# EAGLE design baseboard (EAGLE 9.6.1)
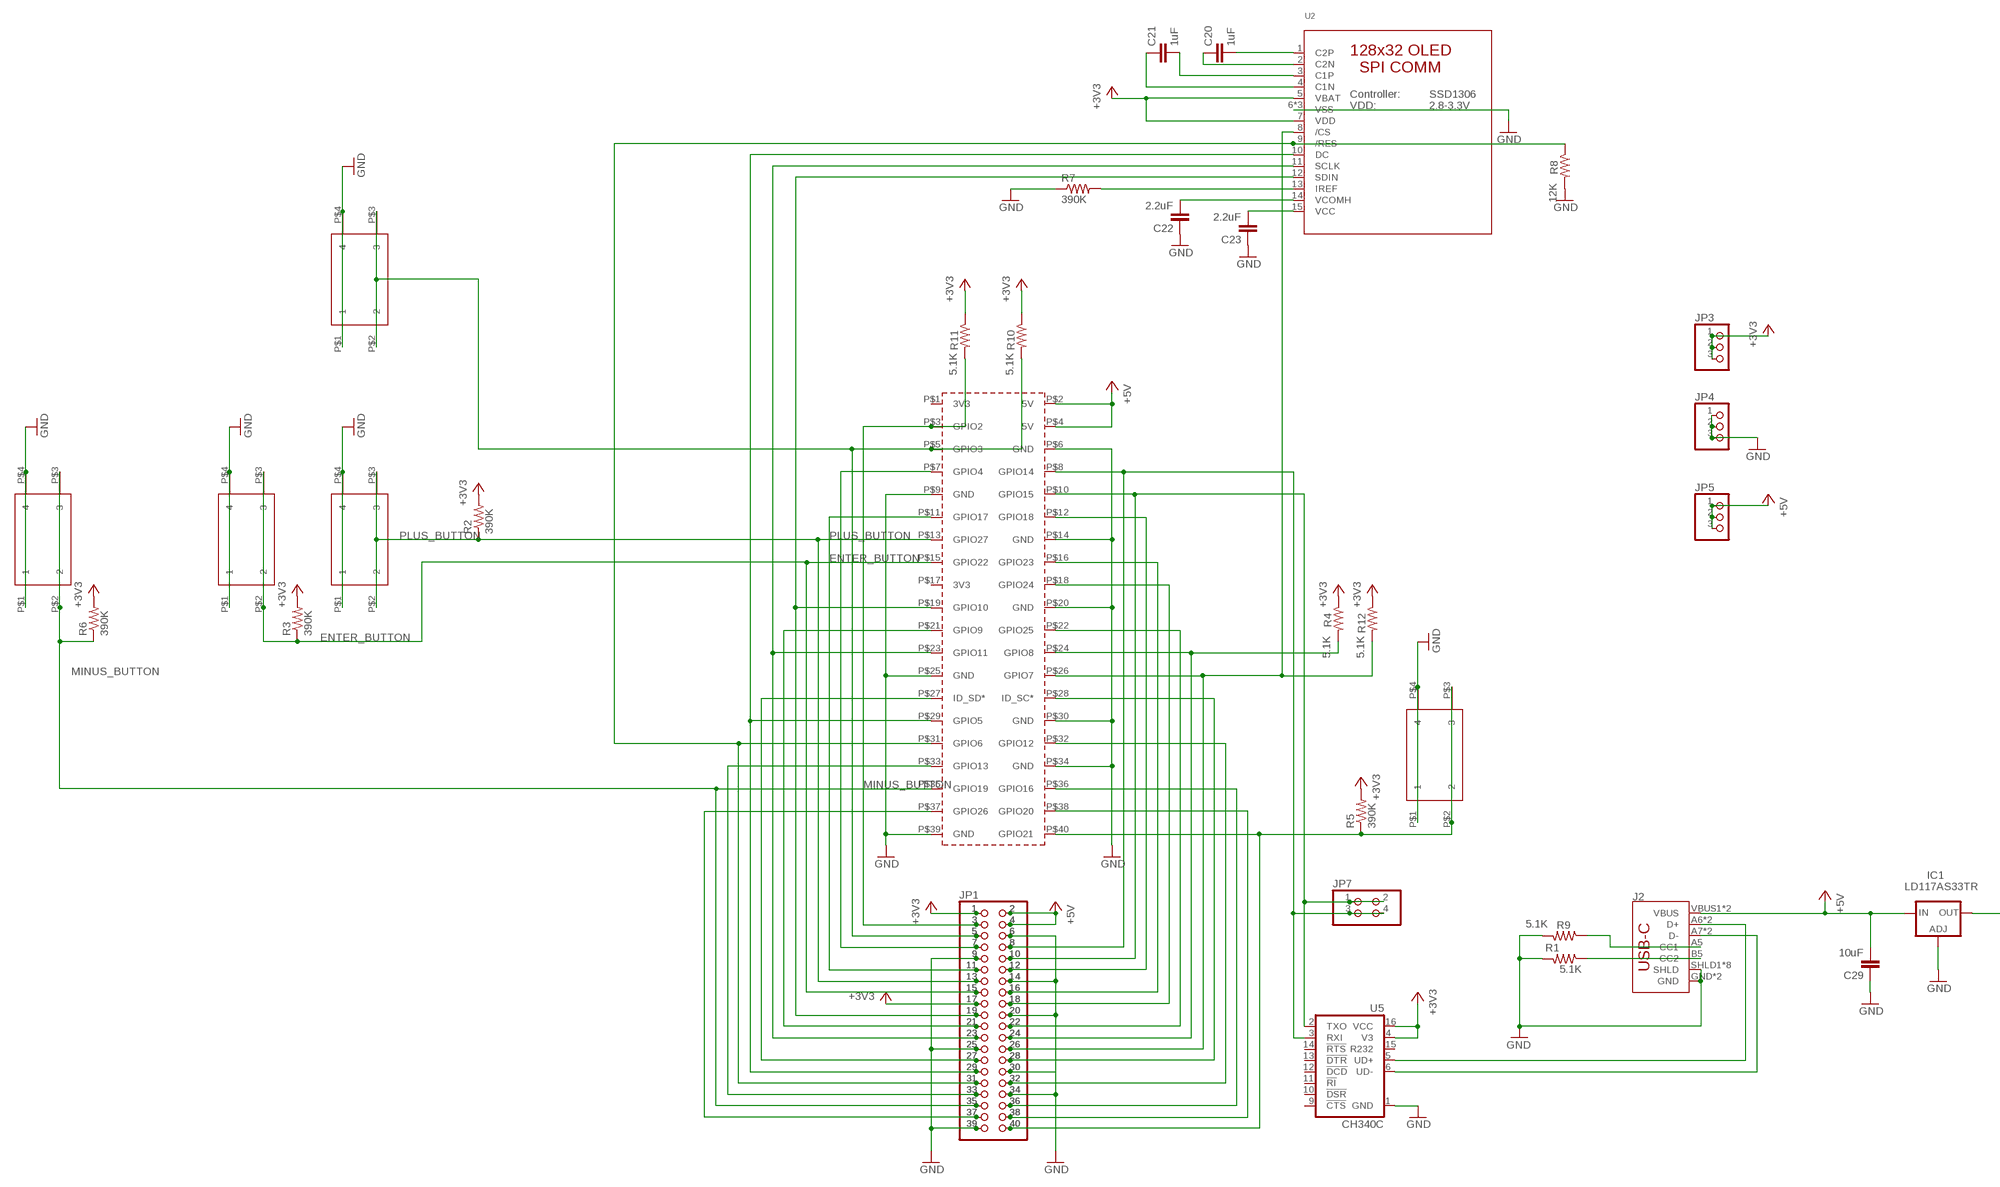
[diagram p0: schematic, sheet 1, part 1 of 2]
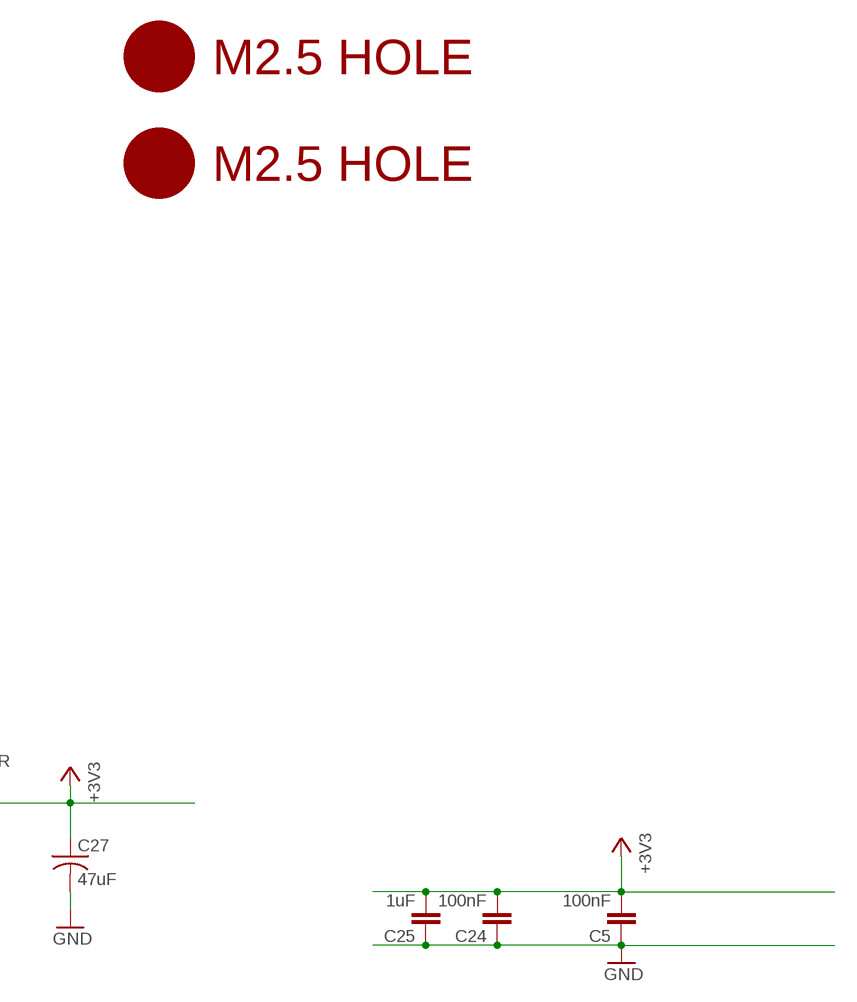
[diagram p1: schematic, sheet 1, part 2 of 2]

## Parts
C5  100nF  CAP0805  [0805]
C20  1uF  CAP0805  [0805]
C21  1uF  CAP0805  [0805]
C22  2.2uF  CAP0805  [0805]
C23  2.2uF  CAP0805  [0805]
C24  100nF  CAP0805  [0805]
C25  1uF  CAP0805  [0805]
C27  47uF  C-USC1210  [C1210]
C29  10uF  CAP0805  [0805]
IC1  LD117AS33TR  [SOT223]
J2  USB_C16PIN  [USB-C-16P]
JP1  PINHD-2X20-BIG  [2X20-BIG]
JP2  PINHD-2X20-BIG  [2X20-BIG]
JP3  PINHD-1X3  [1X03]
JP4  PINHD-1X3  [1X03]
JP5  PINHD-1X3  [1X03]
JP7  PINHD-2X2  [2X02]
PCB1  RPI3NO-CONNECTORS  [RPI3-NO-CONNECTORS]
R1  5.1K  RESISTOR0805-RES  [0805]
R2  390K  RESISTOR0805-RES  [0805]
R3  390K  RESISTOR0805-RES  [0805]
R4  5.1K  RESISTOR0805-RES  [0805]
R5  390K  RESISTOR0805-RES  [0805]
R6  390K  RESISTOR0805-RES  [0805]
R7  390K  RESISTOR0805-RES  [0805]
R8  12K  RESISTOR0805-RES  [0805]
R9  5.1K  RESISTOR0805-RES  [0805]
R10  5.1K  RESISTOR0805-RES  [0805]
R11  5.1K  RESISTOR0805-RES  [0805]
R12  5.1K  RESISTOR0805-RES  [0805]
SW1  324_SW  [342_SWICH_FOOT]
SW2  324_SW  [342_SWICH_FOOT]
SW3  324_SW  [342_SWICH_FOOT]
SW4  324_SW  [342_SWICH_FOOT]
SW20  324_SW  [342_SWICH_FOOT]
U2  LUL_DISP_OLED_UG-2864HSWEG01  [LUL_UG-2864HSWEG01_1.3_WRAPAROUND]
U5  CH340C  [SO016]
U$2  M2.5HOLE  [M2.5HOLE]
U$3  M2.5HOLE  [M2.5HOLE]

## Nets
+3V3: C5.2 C24.2 C25.2 C27.1 IC1.4(OUT) JP1.1 JP1.17 JP2.1 JP2.17 JP3.1 JP3.2 JP3.3 R2.2 R3.2 R4.1 R5.2 R6.2 R10.1 R11.1 R12.1 U2.5(VBAT) U2.7(VDD) U5.4(V3) U5.16(VCC)
+5V: C29.2 IC1.3(IN) J2.VBUS1(VBUS) J2.VBUS2(VBUS) JP1.2 JP1.4 JP2.2 JP2.4 JP5.1 JP5.2 JP5.3 PCB1.P$2(5V) PCB1.P$4(5V)
ENTER_BUTTON: JP1.15 JP2.15 PCB1.P$15(GPIO22) R3.1 SW20.P$2 SW20.P$3
GND: C5.1 C22.1 C23.1 C24.1 C25.1 C27.2 C29.1 IC1.1(ADJ) J2.GND J2.GND2(GND) J2.SHLD1(SHLD) J2.SHLD2(SHLD) J2.SHLD3(SHLD) J2.SHLD4(SHLD) J2.SHLD5(SHLD) J2.SHLD6(SHLD) J2.SHLD7(SHLD) J2.SHLD8(SHLD) JP1.6 JP1.9 JP1.14 JP1.20 JP1.25 JP1.30 JP1.34 JP1.39 JP2.6 JP2.9 JP2.14 JP2.20 JP2.25 JP2.30 JP2.34 JP2.39 JP4.1 JP4.2 JP4.3 PCB1.P$6(GND) PCB1.P$9(GND) PCB1.P$14(GND) PCB1.P$20(GND) PCB1.P$25(GND) PCB1.P$30(GND) PCB1.P$34(GND) PCB1.P$39(GND) R1.2 R7.1 R8.2 R9.2 SW1.P$1 SW1.P$4 SW2.P$1 SW2.P$4 SW3.P$1 SW3.P$4 SW4.P$1 SW4.P$4 SW20.P$1 SW20.P$4 U2.6(VSS) U2.16(VSS) U2.17(VSS) U5.1(GND)
MINUS_BUTTON: JP1.35 JP2.35 PCB1.P$35(GPIO19) R6.1 SW4.P$2 SW4.P$3
N$1: J2.A6(D+) J2.B6(D+) U5.5(UD+)
N$2: J2.A5(CC1) R9.1
N$3: J2.A7(D-) J2.B7(D-) U5.6(UD-)
N$5: JP1.3 JP2.3 PCB1.P$3(GPIO2) R11.2
N$6: JP1.5 JP2.5 PCB1.P$5(GPIO3) R10.2 SW2.P$2 SW2.P$3
N$7: J2.B5(CC2) R1.1
N$8: JP1.7 JP2.7 PCB1.P$7(GPIO4)
N$9: JP1.11 JP2.11 PCB1.P$11(GPIO17)
N$12: JP1.19 JP2.19 PCB1.P$19(GPIO10) U2.12(SDIN)
N$13: JP1.21 JP2.21 PCB1.P$21(GPIO9)
N$14: JP1.23 JP2.23 PCB1.P$23(GPIO11) U2.11(SCLK)
N$15: JP1.27 JP2.27 PCB1.P$27(ID_SD*)
N$16: JP1.29 JP2.29 PCB1.P$29(GPIO5) U2.10(DC)
N$19: JP1.33 JP2.33 PCB1.P$33(GPIO13)
N$21: JP1.37 JP2.37 PCB1.P$37(GPIO26)
N$22: JP1.12 JP2.12 PCB1.P$12(GPIO18)
N$23: JP1.16 JP2.16 PCB1.P$16(GPIO23)
N$24: JP1.18 JP2.18 PCB1.P$18(GPIO24)
N$25: JP1.22 JP2.22 PCB1.P$22(GPIO25)
N$26: JP1.24 JP2.24 PCB1.P$24(GPIO8) R4.2
N$27: JP1.26 JP2.26 PCB1.P$26(GPIO7) R12.2 U2.8(/CS)
N$28: JP1.28 JP2.28 PCB1.P$28(ID_SC*)
N$29: JP1.32 JP2.32 PCB1.P$32(GPIO12)
N$30: JP1.36 JP2.36 PCB1.P$36(GPIO16)
N$31: JP1.38 JP2.38 PCB1.P$38(GPIO20)
N$32: JP1.40 JP2.40 PCB1.P$40(GPIO21) R5.1 SW3.P$2 SW3.P$3
N$35: C20.2 U2.1(C2P)
N$36: C20.1 U2.2(C2N)
N$37: C21.2 U2.3(C1P)
N$38: C21.1 U2.4(C1N)
N$39: R7.2 U2.13(IREF)
N$40: C22.2 U2.14(VCOMH)
N$41: C23.2 U2.15(VCC)
N$43: JP1.31 JP2.31 PCB1.P$31(GPIO6) R8.1 U2.9(/RES)
PLUS_BUTTON: JP1.13 JP2.13 PCB1.P$13(GPIO27) R2.1 SW1.P$2 SW1.P$3
RPI_RX: JP1.10 JP2.10 JP7.1 JP7.2 PCB1.P$10(GPIO15) U5.2(TXO)
RPI_TX: JP1.8 JP2.8 JP7.3 JP7.4 PCB1.P$8(GPIO14) U5.3(RXI)
Unconnected: PCB1.P$1(3V3) PCB1.P$17(3V3) U5.9(!CTS) U5.10(!DSR) U5.11(!RI) U5.12(!DCD) U5.13(!DTR) U5.14(!RTS) U5.15(R232)

## Library data of the parts
C5 C20-C25 C29 = clock:CAP: Capacitor Standard 0603 ceramic capacitor, and 0.1" leaded capacitor.
C27 = clock:C-US: CAPACITOR, American symbol
IC1 = v-reg:LD117A?*: Low drop fixed and adjustable positive voltage regulators 1 A Source: http://www.st.com/stonline/products/literature/ds/7194/ld1117axx.pdf
J2 = SparkFun-Connectors:USB_C: USB Type C 16Pin Connector Super Speed pins not available on the 16-pin purely SMD connector so this part is best for USB 2.0 implementations. D1 and D2 are tied together enabling D+/- no matter which way the cable is plugged into the connector. The two channel configuration pins (CC1/2) are exposed. These are normally connected to ground via 5.1k resistors but can be reconfigured for high current/high power applications.; PROD_ID: CONN-14122
JP1 JP2 = adafruit_changed:PINHD-2X20: PIN HEADER
JP3-JP5 = pinhead:PINHD-1X3: PIN HEADER
JP7 = pinhead:PINHD-2X2: PIN HEADER
PCB1 = e14_Rpi3_RevA:RPI3: Device for Raspberry Pi 3 board created by Dave Young for www.element14.com More information and support community is available at https://www.element14.com/community/community/raspberry-pi
R1 R4 R8-R12 = joyAnalog:RESISTOR: Resistor Basic schematic elements and footprints for 0603, 1206, and PTH resistors.
R2 R3 R5-R7 = SparkFun-Passives:RESISTOR: Resistor Basic schematic elements and footprints for 0603, 1206, and PTH resistors.
SW1-SW4 SW20 = 3pos_slide_switch_centered:324_SW
U2 = lul:LUL_DISP_OLED_UG-2864HSWEG01: UG-2864HSWEG01 OLED display Both 1.3" and 0.96" models share the same FPC tab footprint, only the screen dimensions vary.
U5 = SparkFun-IC-Comms:CH340C; PROD_ID: IC-14038
U$2 U$3 = f1c100s:M2.5HOLE

## Net classes
1 power: width 0.178 mm

## Board
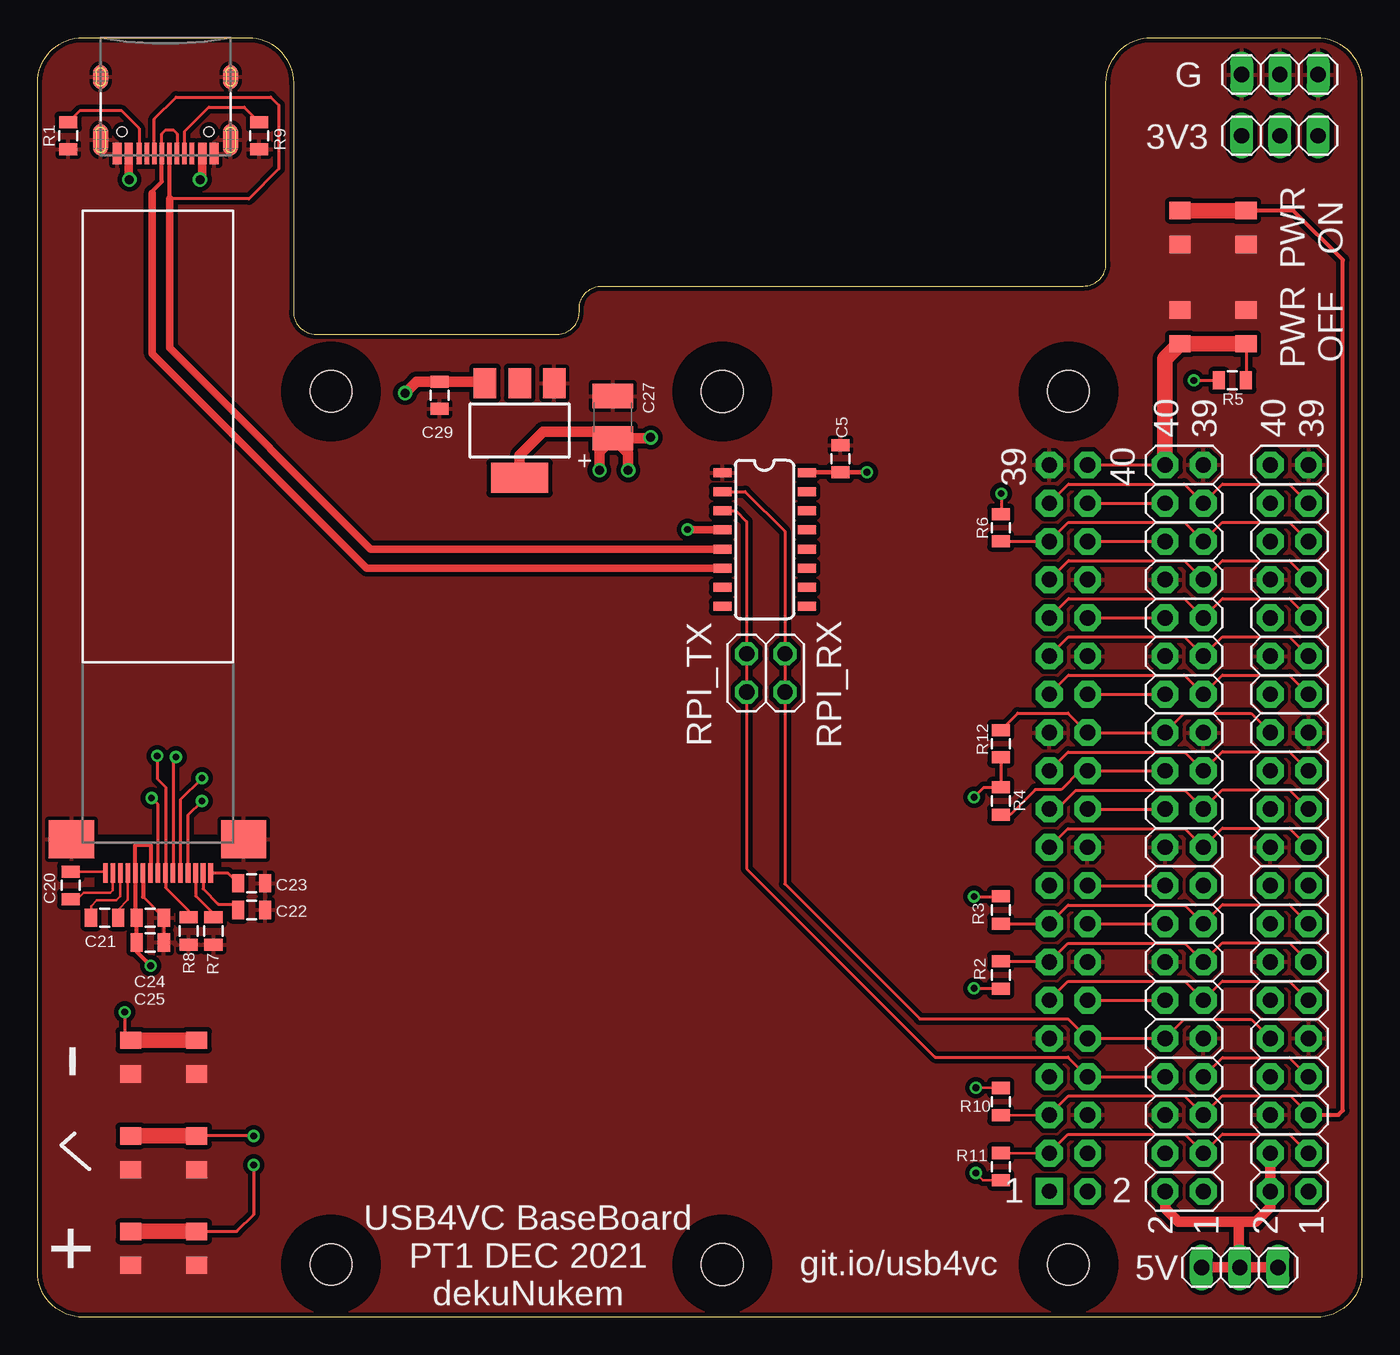
[diagram p2: board, top side]
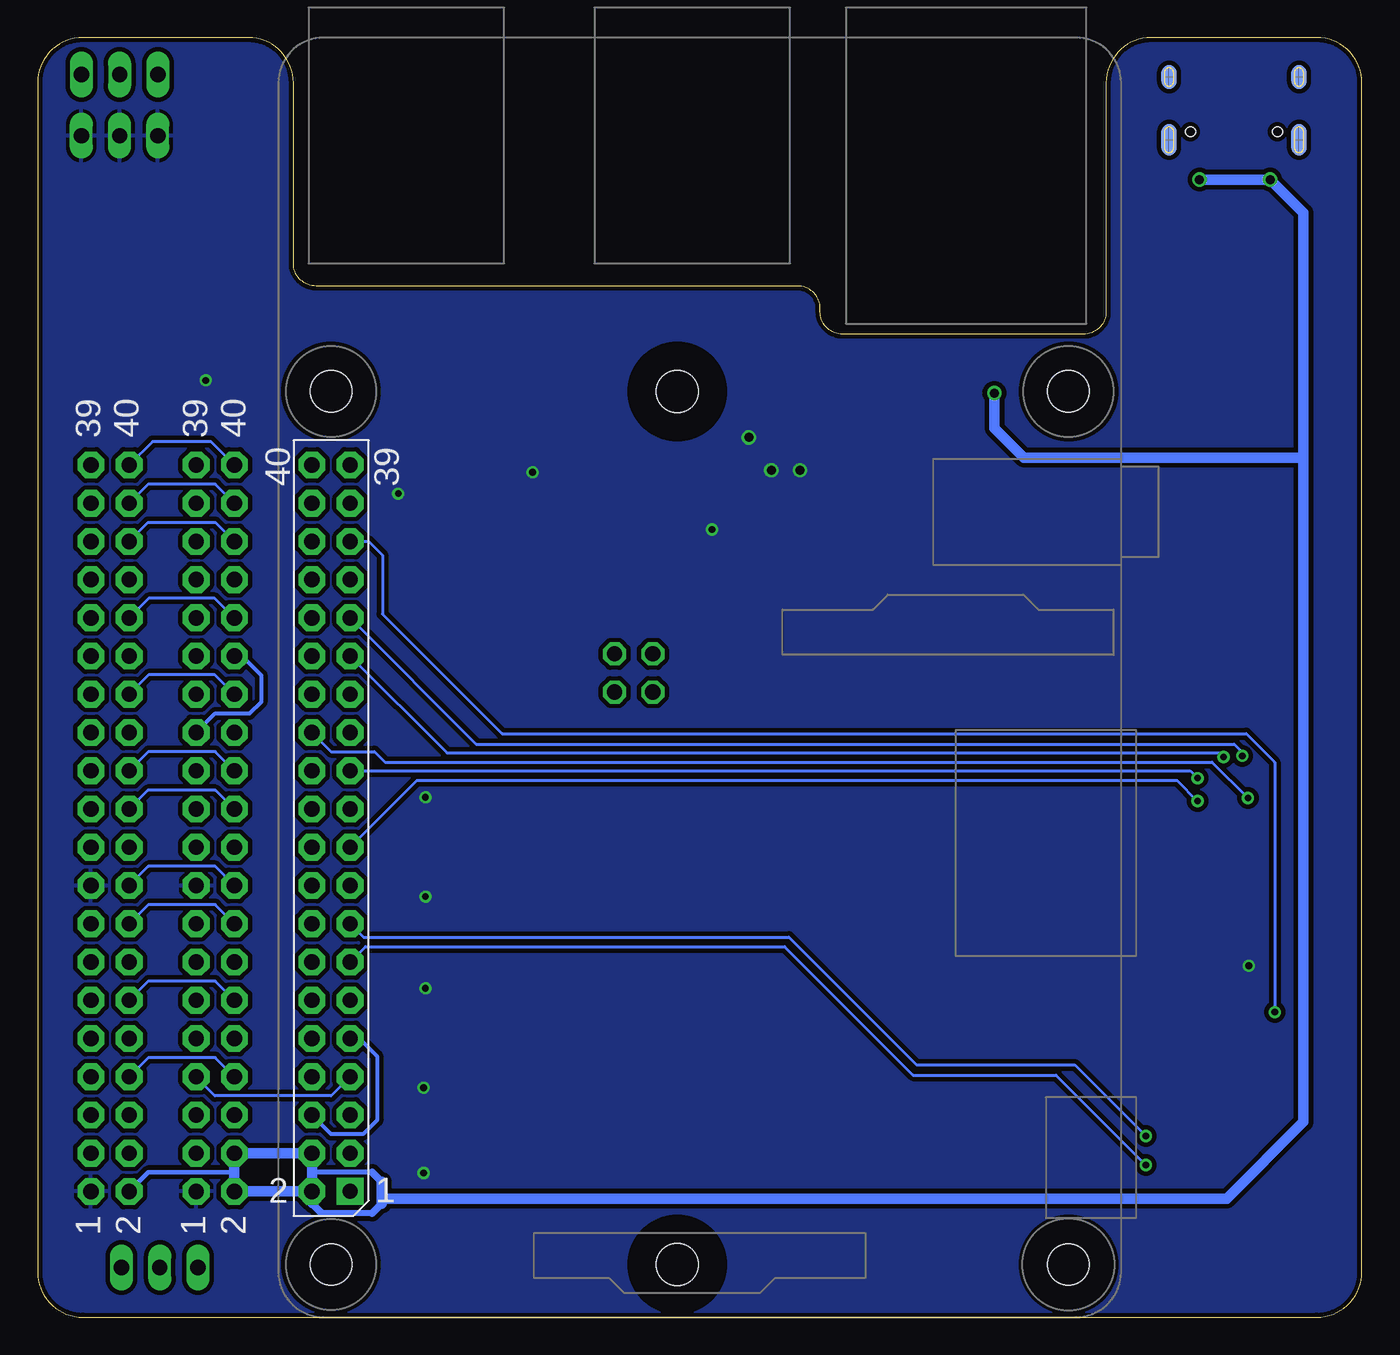
[diagram p3: board, bottom side, seen from below]

Size 88 x 85 mm. Coordinates in mm from the lower left corner, seen from the top.
Outline: 74,85 85,85 arc-90 88,82 88,3 arc-90 85,0 3,0 arc-90 0,3 0,82 arc-90 3,85 14,85 arc-90 17,82 17,66.8 arc90 18.5,65.3 34.5,65.3 arc90 36,66.8 36,67 arc-90 37.5,68.5 69.5,68.5 arc90 71,70 71,82 arc-90 74,85
Copper layers (1*16): Top 0.035mm / dielectric 1.5mm / Bottom 0.035mm
Design rules "deku_2layer_6mil": minimum track width 6mil, minimum drill 15mil, track to track 6mil, track to pad 6mil, pad to pad 6mil, via to via 6mil, smd to smd 6mil, copper to edge 10mil, drill to drill 6mil, minimum pad ring 7mil, minimum via ring 7mil, stop-mask expansion 4mil, vias tented up to drill 25mil, thermal gap 10mil
tRestrict: area 4.1,27.4 to 11.9,31.8; area 65.5,0.5 to 71.5,6.5; area 16.5,0.5 to 22.5,6.5; area 65.5,58.5 to 71.5,64.5; area 16.5,58.5 to 22.5,64.5
bRestrict: area 65.5,58.5 to 71.5,64.5; area 65.5,0.5 to 71.5,6.5; area 16.5,0.5 to 22.5,6.5; area 16.5,58.5 to 22.5,64.5

### Footprints (pad centres in the part's own frame; a part is rotated, then mirrored left to right if it is on the bottom)
0805 = smd 0.8 x 1.2: 1 -0.9,0; 2 0.9,0
C1210 = smd 1.6 x 2.7: 1 -1.4,0; 2 1.4,0
SOT223 = smd 1.5 x 2: 1 -2.3,-3.15; 2 0,-3.15; 3 2.3,-3.15 | smd 3.8 x 2: 4 0,3.15
USB-C-16P = smd 0.3 x 1.45: A5 -1.25,0; A6 -0.25,0; A7 0.25,0; A8 1.25,0; B5 1.75,0; B6 0.75,0; B7 -0.75,0; B8 -1.75,0 | smd 0.6 x 1.45: GND -3.225,0; GND2 3.225,0 | smd 1 x 2.1: SHLD1 -4.32,-0.915; SHLD2 4.32,-0.915 | smd 1 x 2.1 bottom: SHLD3 -4.32,-0.915; SHLD4 4.32,-0.915 | smd 1 x 1.6: SHLD5 -4.32,-5.095; SHLD8 4.32,-5.095 | smd 1 x 1.6 bottom: SHLD6 -4.32,-5.095; SHLD7 4.32,-5.095 | smd 0.55 x 1.45: VBUS1 -2.45,0; VBUS2 2.45,0 | hole 0.65: -2.89,-1.445; 2.89,-1.445
2X20-BIG = drill 1.016 pad 1.778 octagon: 1 -24.13,-1.27; 2 -24.13,1.27; 3 -21.59,-1.27; 4 -21.59,1.27; 5 -19.05,-1.27; 6 -19.05,1.27; 7 -16.51,-1.27; 8 -16.51,1.27; 9 -13.97,-1.27; 10 -13.97,1.27; 11 -11.43,-1.27; 12 -11.43,1.27; 13 -8.89,-1.27; 14 -8.89,1.27; 15 -6.35,-1.27; 16 -6.35,1.27; 17 -3.81,-1.27; 18 -3.81,1.27; 19 -1.27,-1.27; 20 -1.27,1.27; 21 1.27,-1.27; 22 1.27,1.27; 23 3.81,-1.27; 24 3.81,1.27; 25 6.35,-1.27; 26 6.35,1.27; 27 8.89,-1.27; 28 8.89,1.27; 29 11.43,-1.27; 30 11.43,1.27; 31 13.97,-1.27; 32 13.97,1.27; 33 16.51,-1.27; 34 16.51,1.27; 35 19.05,-1.27; 36 19.05,1.27; 37 21.59,-1.27; 38 21.59,1.27; 39 24.13,-1.27; 40 24.13,1.27
1X03 = drill 1.016 long: 1 -2.54,0; 2 0,0; 3 2.54,0
2X02 = drill 1.016 octagon: 1 -1.27,-1.27; 2 -1.27,1.27; 3 1.27,-1.27; 4 1.27,1.27
RPI3-NO-CONNECTORS = drill 1.016 pad 1.778 square: P$1 -8.37,51.23 | drill 1.016 pad 1.778 octagon: P$2 -8.357,53.772; P$3 -10.897,51.232; P$4 -10.897,53.772; P$5 -13.437,51.232; P$6 -13.437,53.772; P$7 -15.977,51.232; P$8 -15.977,53.772; P$9 -18.517,51.232; P$10 -18.517,53.772; P$11 -21.057,51.232; P$12 -21.057,53.772; P$13 -23.597,51.232; P$14 -23.597,53.772; P$15 -26.137,51.232; P$16 -26.137,53.772; P$17 -28.677,51.232; P$18 -28.677,53.772; P$19 -31.217,51.232; P$20 -31.217,53.772; P$21 -33.757,51.232; P$22 -33.757,53.772; P$23 -36.297,51.232; P$24 -36.297,53.772; P$25 -38.837,51.232; P$26 -38.837,53.772; P$27 -41.377,51.232; P$28 -41.377,53.772; P$29 -43.917,51.232; P$30 -43.917,53.772; P$31 -46.457,51.232; P$32 -46.457,53.772; P$33 -48.997,51.232; P$34 -48.997,53.772; P$35 -51.537,51.232; P$36 -51.537,53.772; P$37 -54.077,51.232; P$38 -54.077,53.772; P$39 -56.617,51.232; P$40 -56.617,53.772 | hole 2.75: -3.5,3.5; -61.5,3.5; -3.5,52.5; -61.5,52.5
342_SWICH_FOOT = smd 1.4 x 1.15: P$1 -2.2,-1.125; P$2 -2.2,1.125; P$3 2.2,1.125; P$4 2.2,-1.125
LUL_UG-2864HSWEG01_1.3_WRAPAROUND = smd 0.31 x 1.28: 1 3.5,0; 2 3,0; 3 2.5,0; 4 2,0; 5 1.5,0; 6 1,0; 7 0.5,0; 8 0,0; 9 -0.5,0; 10 -1,0; 11 -1.5,0; 12 -2,0; 13 -2.5,0; 14 -3,0; 15 -3.5,0 | smd 3 x 2.5: 16 5.75,-2.24; 17 -5.7,-2.24
SO016 = smd 0.6 x 1.2: 1 -4.445,-2.8; 2 -3.175,-2.8; 3 -1.905,-2.8; 4 -0.635,-2.8; 5 0.635,-2.8; 6 1.905,-2.8; 7 3.175,-2.8; 8 4.445,-2.8; 9 4.445,2.8; 10 3.175,2.8; 11 1.905,2.8; 12 0.635,2.8; 13 -0.635,2.8; 14 -1.905,2.8; 15 -3.175,2.8; 16 -4.445,2.8
M2.5HOLE = hole 2.8: 0,0

### Placement (x,y rotation side)
C5  53.34,57.02 270 top
C20  2.2,28.68 90 top
C21  4.45,26.54 180 top
C22  14.22,27.05 180 top
C23  14.22,28.83 180 top
C24  7.49,26.54 180 top
C25  7.49,24.89 180 top
C27  38.23,59.79 90 top
C29  26.71,61.25 90 top
IC1  32.03,58.9 180 top
J2  8.5,77.3 180 top
JP1  76.2,32.49 90 top
JP2  83.19,32.49 90 top
JP3  82.55,78.49 0 top
JP4  82.55,82.55 180 top
JP5  79.88,3.3 0 top
JP7  48.39,42.8 180 top
PCB1  16,0 270 top
R1  2.03,78.49 270 top
R2  64.01,22.73 270 top
R3  64.01,27.05 90 top
R4  64.01,34.29 270 top
R5  79.4,62.23 180 top
R6  64.01,52.45 90 top
R7  11.68,25.65 90 top
R8  10.03,25.65 270 top
R9  14.73,78.49 270 top
R10  64.01,14.33 270 top
R11  64.01,10.01 90 top
R12  64.01,38.1 90 top
SW1  8.38,4.57 0 top
SW2  78.11,72.39 0 top
SW3  78.11,65.79 180 top
SW4  8.38,17.27 0 top
SW20  8.38,10.92 0 top
U2  8,29.51 180 top
U5  48.31,51.66 270 top
U$2  45.5,3.5 0 top
U$3  45.5,61.5 0 top

### Tracks (layer width: path | path; a pad name or v marks a point on that pad's centre or on a via)
+3V3  (via drill 0.45, 0.6)
  Top 0.152: C24.2 6.54,26.6 | v62.36,9.58 62.83,9.11 R11.1 | v62.36,15.24 63.99,15.24 R10.1
  Top 0.203: v62.23,21.84 64,21.84 R2.2 | v62.23,27.94 64,27.94 R3.2 | v76.83,62.23 R5.2 | v64.03,54.71 64.03,53.38 R6.2 | R12.1 R4.1 62.88,35.19 v62.23,34.54
  Top 0.254: v7.52,23.34 6.59,24.27 C25.2 C24.2 | 6.54,26.6 6.5,26.64 U2.5 6.5,31.37 7.5,31.37 U2.7
  Top 0.305: v55.12,56.13 55.11,56.12 C5.2 51.12,56.12 U5.16
  Top 0.508: v43.18,52.32 45.48,52.32 U5.4
  Top 0.711: IC1.4 32.03,57.25 33.6,58.82 37.8,58.82 C27.1 | C27.1 37.34,57.5 v37.34,56.26 | C27.1 39.24,57.38 v39.24,56.26 | C27.1 40.69,58.39 v40.74,58.45
  pour Bottom (isolate 0.305, rank 2): 0,0 0,85 88,85 88,0
+5V  (via drill 0.6)
  Top 0.508: 6.05,75.61 v6.1,75.56 | 10.95,75.72 v10.79,75.56
  Top 0.559: J2.VBUS2 6.05,75.61 | J2.VBUS1 10.95,75.72
  Top 0.61: 29.63,62.15 IC1.3
  Top 0.711: JP1.2 74.93,7.19 75.79,6.33 79.83,6.33 | 79.83,6.33 80.95,6.33 81.92,7.29 JP2.2 JP2.4 | v24.42,61.39 25.18,62.15 C29.2 29.63,62.15 | 79.83,6.33 79.83,3.35 | 79.83,3.35 JP5.2 JP5.3 | JP5.1 79.78,3.3 79.83,3.35
  Bottom 0.305: 74.93,9.68 74.98,9.63 80.64,9.63 JP2.2
  Bottom 0.33: 65.76,9.63 69.77,9.63
  Bottom 0.406: 65.76,6.91 69.14,6.91
  Bottom 0.508: 65.13,7.54 65.76,6.91 | 69.14,6.91 69.77,7.54 | 65.76,9.63 65.13,8.99
  Bottom 0.61: 69.77,7.54 PCB1.P$2 | JP1.2 74.91,8.36
  Bottom 0.711: v10.79,75.56 v6.1,75.56 3.89,73.36 3.89,57.1 | 65.13,8.99 65.13,7.87 | 65.13,7.87 65.13,7.54 | 74.91,8.36 PCB1.P$2 69.77,9.63 PCB1.P$4 JP1.4 74.93,9.68 JP1.2 | 65.13,7.87 8.99,7.87 3.89,12.98 3.89,57.1 | v24.42,61.39 24.42,59.06 22.45,57.1 3.89,57.1
ENTER_BUTTON  (via drill 0.45)
  Top 0.203: JP2.15 83.19,27.41 78.74,27.41 JP1.15 76.22,27.38 68.48,27.38 PCB1.P$15 67.22,26.15 R3.1 | v14.35,12.04 10.72,12.04 SW20.P$3
  Top 1.016: SW20.P$2 10.71,12.05 10.72,12.04
  Bottom 0.203: PCB1.P$15 66.34,25.25 38.08,25.25 29.59,16.76 19.07,16.76 v14.35,12.04
GND
  Top 0.203: 7,27.93 C24.1 C25.1
  Top 0.254: U2.6 7,27.93
  Bottom 0.254: JP1.25 76.2,40.11 73.91,40.11 73.13,40.89 73.13,42.62 74.42,43.92 JP1.30 | PCB1.P$9 66.62,18.52 65.46,17.35 65.46,13.08 66.37,12.17 68.5,12.17 PCB1.P$6
  pour Top (isolate 0.305): 0,85 0,0 88,0 88,85
MINUS_BUTTON  (via drill 0.45)
  Top 0.203: JP2.35 83.19,52.81 78.74,52.81 JP1.35 76.2,52.81 68.5,52.81 PCB1.P$35 67.22,51.55 R6.1 | v5.79,20.27 5.79,18.79 SW4.P$2
  Top 1.016: SW4.P$2 SW4.P$3
  Bottom 0.203: PCB1.P$35 65.99,51.54 65.08,50.62 65.08,46.71 57.12,38.76 7.7,38.76 5.79,36.85 v5.79,20.27
N$1
  Top 0.203: J2.B6 7.75,79.61 9.2,81.05 15.49,81.05 16.03,80.52 16.03,76.28 14.05,74.3 8.76,74.3
  Top 0.254: J2.A6 8.75,74.31 8.76,74.3
  Top 0.508: 8.76,74.3 8.76,64.39 22.12,51.03 U5.5
N$2
  Top 0.203: J2.A5 9.75,78.76 11.38,80.39 13.73,80.39 R9.1
N$3
  Top 0.203: J2.A7 8.25,78.61 8.51,78.87 9.02,78.87 9.27,78.61 9.27,77.32 J2.B7
  Top 0.254: J2.A7 8.26,75.44 7.62,74.8 7.62,74.68
  Top 0.508: 7.62,74.68 7.62,64.01 21.87,49.76 U5.6
N$5
  Top 0.152: R11.2 PCB1.P$3
  Top 0.203: PCB1.P$3 68.48,12.14 76.22,12.14 JP1.3 78.74,12.17 83.19,12.17 JP2.3
N$6
  Top 0.152: R10.2 67.19,13.43 67.22,13.45
  Top 0.203: JP2.5 84.45,13.49 83.24,14.71 78.74,14.71 JP1.5 76.2,14.71 68.5,14.71 PCB1.P$5 67.22,13.45
  Top 0.254: JP2.5 86.44,13.44 86.74,13.74 86.74,70.23 83.46,73.52 SW2.P$3
  Top 1.016: SW2.P$2 SW2.P$3
N$7
  Top 0.203: J2.B5 6.75,78.97 5.59,80.14 2.78,80.14 R1.1
N$8
  Top 0.203: JP1.7 78.74,17.25 83.19,17.25 JP2.7
  Bottom 0.203: PCB1.P$7 68.5,14.71 76.22,14.71 77.47,15.95 JP1.7
N$9
  Top 0.203: PCB1.P$11 68.48,22.3 76.22,22.3 JP1.11 78.74,22.33 83.19,22.33 JP2.11
N$12  (via drill 0.45)
  Top 0.203: PCB1.P$19 68.48,32.46 76.22,32.46 JP1.19 78.74,32.49 83.19,32.49 JP2.19 | U2.12 10,33.37 v10.92,34.29
  Bottom 0.203: PCB1.P$19 62.79,35.66 12.29,35.66 v10.92,34.29
N$13
  Top 0.203: PCB1.P$21 67.74,33.76 68.98,35 76.22,35 JP1.21 78.74,35.03 83.19,35.03 JP2.21
N$14  (via drill 0.45)
  Top 0.203: PCB1.P$23 68.48,37.54 76.22,37.54 JP1.23 78.74,37.57 83.19,37.57 JP2.23 | U2.11 9.5,34.39 v10.92,35.81
  Bottom 0.203: PCB1.P$23 11.4,36.3 v10.92,35.81
N$15
  Top 0.203: PCB1.P$27 68.5,42.65 76.2,42.65 JP1.27 78.74,42.65 83.19,42.65 JP2.27
N$16  (via drill 0.45)
  Top 0.203: PCB1.P$29 68.5,45.19 76.2,45.19 JP1.29 78.74,45.19 83.19,45.19 JP2.29 | v9.2,37.21 9,37.02 U2.10
  Bottom 0.203: PCB1.P$29 60.81,37.49 9.47,37.49 v9.2,37.21
N$19
  Top 0.203: PCB1.P$33 68.5,50.27 76.2,50.27 JP1.33 78.74,50.27 83.19,50.27 JP2.33
N$21
  Top 0.203: PCB1.P$37 68.5,55.35 76.2,55.35 JP1.37 78.74,55.35 83.19,55.35 JP2.37
N$22
  Top 0.203: PCB1.P$12 JP1.12
  Bottom 0.203: JP1.12 76.2,22.33 80.64,22.33 JP2.12
N$23
  Top 0.203: PCB1.P$16 JP1.16
  Bottom 0.203: JP1.16 76.2,27.41 80.64,27.41 JP2.16
N$24
  Top 0.203: PCB1.P$18 JP1.18
  Bottom 0.203: JP1.18 76.2,29.95 80.64,29.95 JP2.18
N$25
  Top 0.203: PCB1.P$22 JP1.22
  Bottom 0.203: JP1.22 76.17,35 80.67,35 JP2.22
N$26
  Top 0.203: JP1.24 PCB1.P$24 69.27,36.3 68.02,35.05 66.29,35.05 64.63,33.39 R4.2
  Bottom 0.203: JP1.24 76.2,37.57 80.64,37.57 JP2.24
N$27  (via drill 0.45)
  Top 0.203: JP2.26 80.64,40.11 76.2,40.11 JP1.26 PCB1.P$26 68.48,40.13 65.14,40.13 R12.2 | v7.57,34.49 8,34.06 U2.8
  Bottom 0.203: v7.57,34.49 9.96,36.88 64.92,36.88 65.61,37.57 68.5,37.57 PCB1.P$26
N$28
  Top 0.203: PCB1.P$28 JP1.28
  Bottom 0.203: JP1.28 76.22,42.67 80.62,42.67 JP2.28
N$29
  Top 0.203: PCB1.P$32 JP1.32
  Bottom 0.203: JP1.32 76.22,47.75 80.62,47.75 JP2.32
N$30
  Top 0.203: PCB1.P$36 JP1.36
  Bottom 0.203: JP1.36 76.17,52.78 80.67,52.78 JP2.36
N$31
  Top 0.203: PCB1.P$38 JP1.38
  Bottom 0.203: JP1.38 76.2,55.35 80.64,55.35 JP2.38
N$32
  Top 0.203: PCB1.P$40 JP1.40 | SW3.P$2 R5.1
  Top 1.016: JP1.40 74.91,56.63 74.91,63.67 SW3.P$3 SW3.P$2
  Bottom 0.203: JP1.40 76.48,58.17 80.37,58.17 JP2.40
N$35
  Top 0.152: C20.2 4.43,29.58 U2.1
N$36
  Top 0.152: C20.1 2.63,27.78 3.05,28.19 4.83,28.19 5,28.37 U2.2
N$37
  Top 0.152: U2.3 5.5,27.98 5.21,27.69 3.94,27.69 3.54,27.29 C21.2
N$38
  Top 0.152: U2.4 6,27.72 5.34,27.06 C21.1
N$39
  Top 0.203: U2.13 10.5,27.98 11.68,26.8 R7.2
N$40
  Top 0.203: U2.14 11,28.45 12.01,27.43 12.94,27.43 C22.2
N$41
  Top 0.203: U2.15 12.64,29.51 C23.2
N$43  (via drill 0.45)
  Top 0.203: PCB1.P$31 68.5,47.73 76.2,47.73 JP1.31 78.74,47.73 83.19,47.73 JP2.31 | v7.95,37.29 7.95,35.76 8.5,35.21 U2.9 8.5,28.53 10.03,27 R8.1
  Bottom 0.203: PCB1.P$31 58.85,38.08 8.48,38.08 7.95,37.54 v7.95,37.29
PLUS_BUTTON  (via drill 0.45)
  Top 0.203: JP2.13 83.19,24.87 78.74,24.87 JP1.13 76.22,24.84 68.48,24.84 PCB1.P$13 67.19,23.63 R2.1 | v14.35,10.11 14.35,6.81 13.24,5.7 SW1.P$3
  Top 1.016: SW1.P$2 SW1.P$3
  Bottom 0.203: PCB1.P$13 66.22,24.61 38.35,24.61 29.82,16.08 20.32,16.08 v14.35,10.11
RPI_RX
  Top 0.203: U5.2 47.02,54.84 49.66,52.2 JP7.1 JP7.2 49.66,28.78 58.62,19.81 68.48,19.81 PCB1.P$10 JP1.10 76.2,19.79 80.64,19.79 JP2.10
RPI_TX
  Top 0.203: JP1.8 PCB1.P$8 68.48,17.27 59.64,17.27 47.12,29.79 JP7.4 JP7.3 47.12,52.86 46.41,53.57 U5.3
  Bottom 0.203: JP1.8 76.2,17.25 80.64,17.25 JP2.8

### Text on the board
tNames: G | 3V3 | PWR / ON | PWR / OFF | 39 | 40 | 40 | 39 | 40 | 39 | RPI_TX | RPI_RX | - | - | 1 | 2 | + | 2 | 1 | 2 | 1 | USB4VC BaseBoard / PT1 DEC 2021 / dekuNukem | git.io/usb4vc | 5V
bNames: 39 | 40 | 40 | 39 | 40 | 39 | 2 | 1 | 2 | 1 | 2 | 1